# EAGLE design ssslidar_v0.1_main_board (EAGLE 7.6.0)
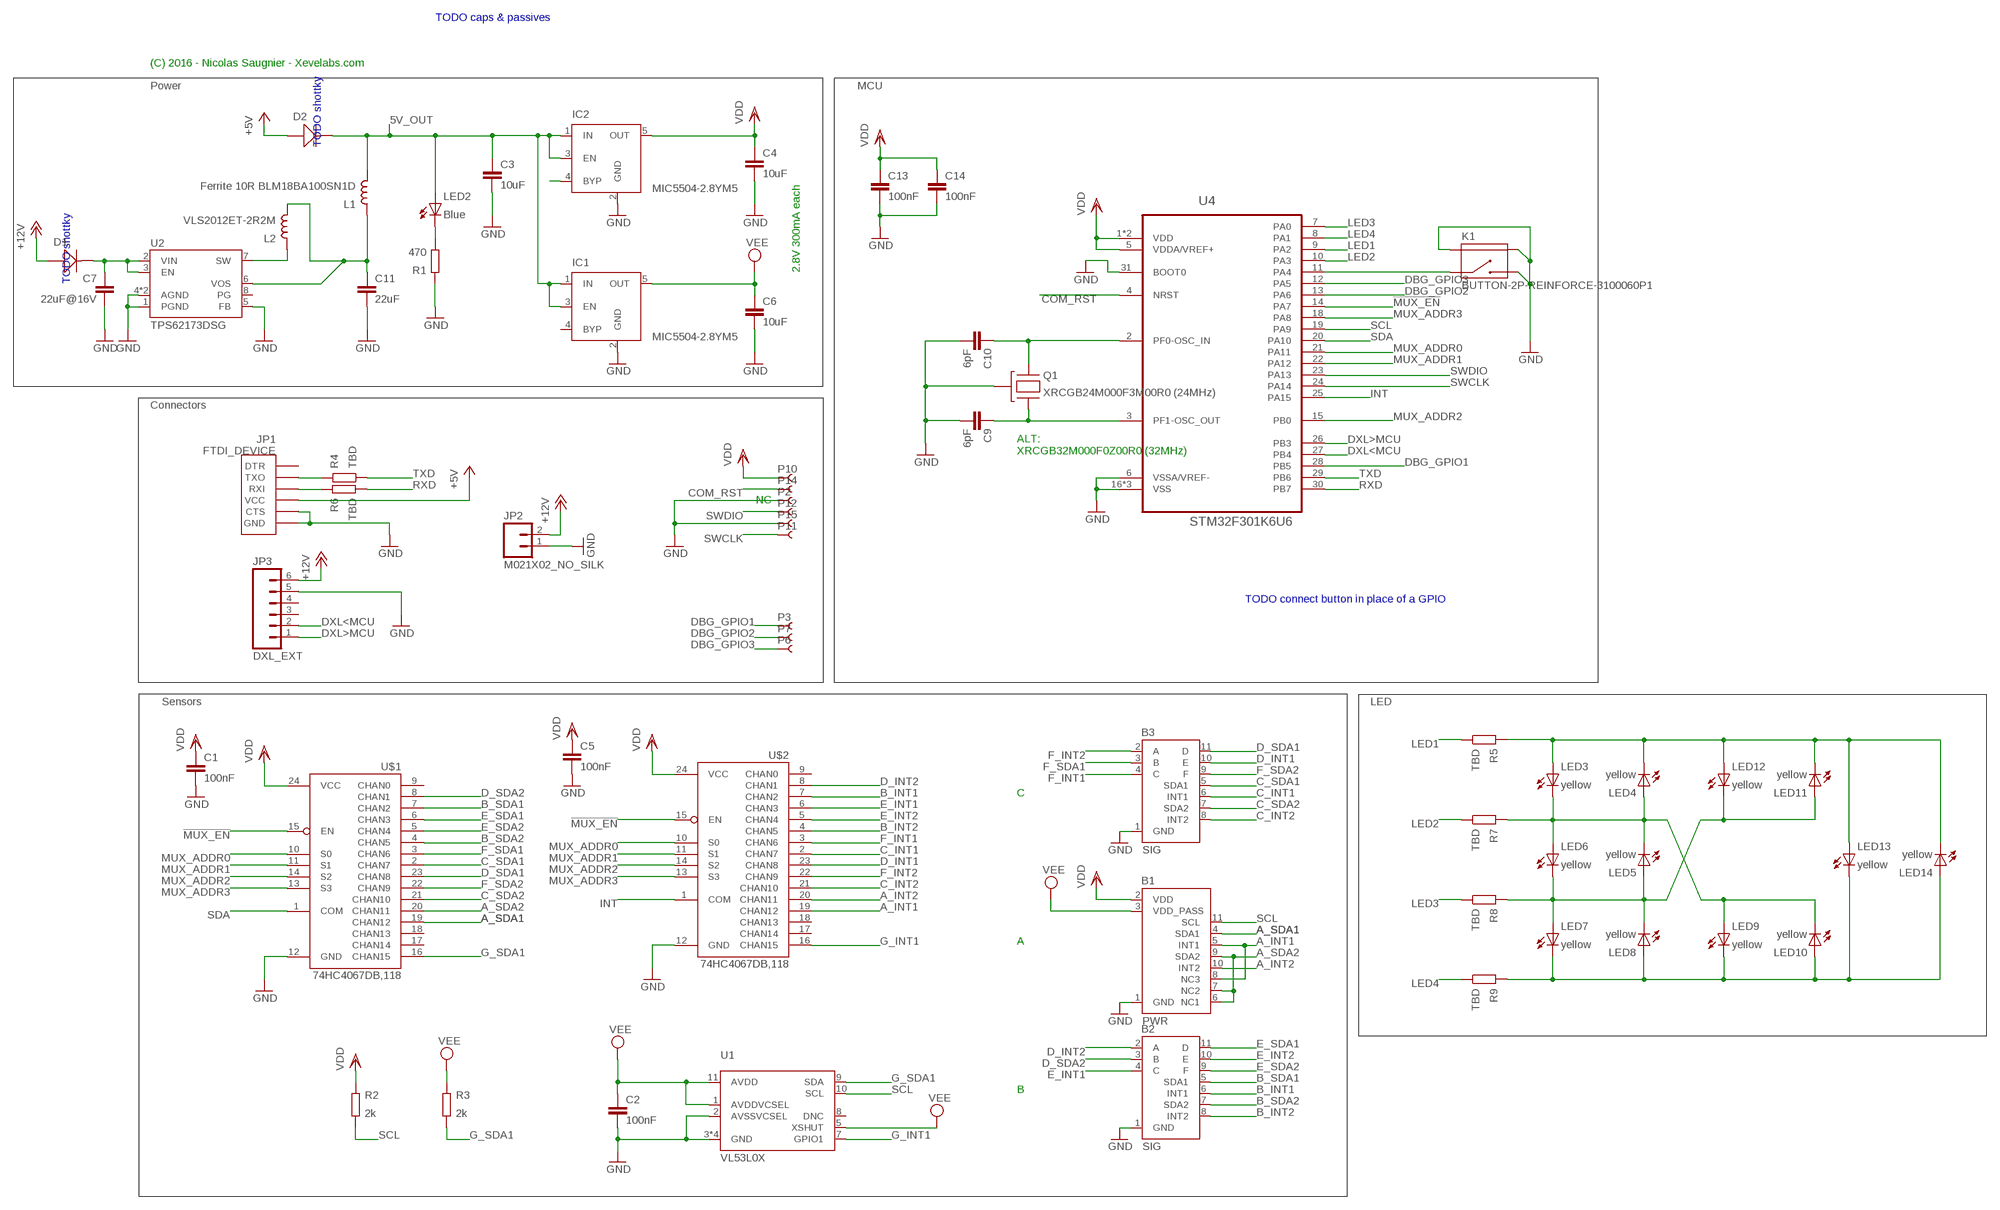
[diagram p0: schematic, sheet 1]

## Parts
B1  PWR  BLADE_PWR_BOTTOM  [BLADE]
B2  SIG  BLADE_SIG_BOTTOM  [BLADE]
B3  SIG  BLADE_SIG_BOTTOM  [BLADE]
C1  100nF  C0402  [0402_N]
C2  100nF  C0402  [0402_N]
C3  10uF  C0805  [0805_N]
C4  10uF  C0805  [0805_N]
C5  100nF  C0402  [0402_N]
C6  10uF  C0805  [0805_N]
C7  22uF@16V  C1206_L  [1206_L]
C9  6pF  C0402  [0402_N]
C10  6pF  C0402  [0402_N]
C11  22uF  C1206_L  [1206_L]
C13  100nF  C0402  [0402_N]
C14  100nF  C0402  [0402_N]
D1  D-SOD-123  [SOD123]
D2  D-SOD-123  [SOD123]
IC1  MIC5504-2.8YM5  MIC5219XX  [SOT23-5]
IC2  MIC5504-2.8YM5  MIC5219XX  [SOT23-5]
JP1  FTDI_DEVICE  [FTDI_DEVICE_SIDE]
JP2  M021X02_NO_SILK  [1X02_NO_SILK]
JP3  DXL_EXT  M061.27MM  [1X06-1.27MM]
K1  BUTTON-2P-REINFORCE-3100060P1  [4P-SMD-7.0X3.5X3.5H-90D]
L1  Ferrite 10R BLM18BA100SN1D  L0603  [0603_N]
L2  VLS2012ET-2R2M  L2016M  [2016_METRIC_N]
LED2  Blue  LED0603  [D_0603_N]
LED3  yellow  LED0603  [D_0603_N]
LED4  yellow  LED0603  [D_0603_N]
LED5  yellow  LED0603  [D_0603_N]
LED6  yellow  LED0603  [D_0603_N]
LED7  yellow  LED0603  [D_0603_N]
LED8  yellow  LED0603  [D_0603_N]
LED9  yellow  LED0603  [D_0603_N]
LED10  yellow  LED0603  [D_0603_N]
LED11  yellow  LED0603  [D_0603_N]
LED12  yellow  LED0603  [D_0603_N]
LED13  yellow  LED0603  [D_0603_N]
LED14  yellow  LED0603  [D_0603_N]
P2  PIN_SMD_1X1.6  [PIN_SMD_1X1.6]
P3  PIN_SMD_1X1  [PIN_SMD_1X1]
P6  PIN_SMD_1X1  [PIN_SMD_1X1]
P7  PIN_SMD_1X1  [PIN_SMD_1X1]
P10  PIN_SMD_1X1.6  [PIN_SMD_1X1.6]
P11  PIN_SMD_1X1.6  [PIN_SMD_1X1.6]
P12  PIN_SMD_1X1.6  [PIN_SMD_1X1.6]
P14  PIN_SMD_1X1.6  [PIN_SMD_1X1.6]
P15  PIN_SMD_1X1.6  [PIN_SMD_1X1.6]
Q1  XRCGB24M000F3M00R0 (24MHz)  CRYSTAL_W/BODY-2.0X1.6  [CRYSTAL_2.0X1.6_4P]
R1  470  R0402  [0402_N]
R2  2k  R0402  [0402_N]
R3  2k  R0402  [0402_N]
R4  TBD  R0402  [0402_N]
R5  TBD  R0402  [0402_N]
R6  TBD  R0402  [0402_N]
R7  TBD  R0402  [0402_N]
R8  TBD  R0402  [0402_N]
R9  TBD  R0402  [0402_N]
U1  VL53L0X  [VL53L0X]
U2  TPS62173DSG  IC_TPS62160DSG_N  [SON50P200X200X80-9N]
U4  STM32F301K6U6  [QFN50P500X500X60-33N]
U$1  74HC4067DB,118  MUX-74HC4067SMD  [SSOP24]
U$2  74HC4067DB,118  MUX-74HC4067SMD  [SSOP24]

## Nets
5V_OUT: C3.1 D2.- IC1.1(IN) IC1.3(EN) IC2.1(IN) IC2.3(EN) L1.2 LED2.A
!MUX_EN: U4.14(PA7) U$1.15(EN) U$2.15(EN)
+5V: D2.+ JP1.P$4(VCC)
+12V: D1.+ JP2.2 JP3.6
A_INT1: B1.5(INT1) B1.8(NC3) U$2.19(CHAN12)
A_INT2: B1.10(INT2) U$2.20(CHAN11)
A_SDA1: B1.4(SDA1) U$1.19(CHAN12)
A_SDA2: B1.6(NC1) B1.7(NC2) B1.9(SDA2) U$1.20(CHAN11)
B_INT1: B2.6(INT1) U$2.7(CHAN2)
B_INT2: B2.8(INT2) U$2.4(CHAN5)
B_SDA1: B2.5(SDA1) U$1.7(CHAN2)
B_SDA2: B2.7(SDA2) U$1.4(CHAN5)
C_INT1: B3.6(INT1) U$2.2(CHAN7)
C_INT2: B3.8(INT2) U$2.21(CHAN10)
C_SDA1: B3.5(SDA1) U$1.2(CHAN7)
C_SDA2: B3.7(SDA2) U$1.21(CHAN10)
COM_RST: P14.PIN U4.4(NRST)
D_INT1: B3.10(E) U$2.23(CHAN8)
D_INT2: B2.2(A) U$2.8(CHAN1)
D_SDA1: B3.11(D) U$1.23(CHAN8)
D_SDA2: B2.3(B) U$1.8(CHAN1)
DBG_GPIO1: P3.P$1 U4.28(PB5)
DBG_GPIO2: P7.P$1 U4.13(PA6)
DBG_GPIO3: P6.P$1 U4.12(PA5)
DXL<MCU: JP3.2 U4.27(PB4)
DXL>MCU: JP3.1 U4.26(PB3)
E_INT1: B2.4(C) U$2.6(CHAN3)
E_INT2: B2.10(E) U$2.5(CHAN4)
E_SDA1: B2.11(D) U$1.6(CHAN3)
E_SDA2: B2.9(F) U$1.5(CHAN4)
F_INT1: B3.4(C) U$2.3(CHAN6)
F_INT2: B3.2(A) U$2.22(CHAN9)
F_SDA1: B3.3(B) U$1.3(CHAN6)
F_SDA2: B3.9(F) U$1.22(CHAN9)
G_INT1: U1.7(GPIO1) U$2.16(CHAN15)
G_SDA1: R3.1 U1.9(SDA) U$1.16(CHAN15)
GND: B1.1(GND) B2.1(GND) B3.1(GND) C1.2 C2.2 C3.2 C4.2 C5.2 C6.2 C7.2 C9.2 C10.2 C11.2 C13.2 C14.2 IC1.2(GND) IC2.2(GND) JP1.P$5(CTS) JP1.P$6(GND) JP2.1 JP3.5 K1.2 K1.S1 K1.S2 P2.PIN P15.PIN Q1.2(GND) Q1.4(GND) R1.2 U1.2(AVSSVCSEL) U1.3(GND) U1.4(GND) U1.6(GND) U1.12(GND) U2.1(PGND) U2.4(AGND) U2.5(FB) U2.9(AGND) U4.6(VSSA/VREF-) U4.16(VSS) U4.31(BOOT0) U4.32(VSS) U4.33(VSS) U$1.12(GND) U$2.12(GND)
INT: U4.25(PA15) U$2.1(COM)
LED1: R5.1 U4.9(PA2)
LED2: R7.1 U4.10(PA3)
LED3: R8.1 U4.7(PA0)
LED4: R9.1 U4.8(PA1)
MUX_ADDR0: U4.21(PA11) U$1.10(S0) U$2.10(S0)
MUX_ADDR1: U4.22(PA12) U$1.11(S1) U$2.11(S1)
MUX_ADDR2: U4.15(PB0) U$1.14(S2) U$2.14(S2)
MUX_ADDR3: U4.18(PA8) U$1.13(S3) U$2.13(S3)
N$1: C10.1 Q1.1 U4.2(PF0-OSC_IN)
N$2: C9.1 Q1.3 U4.3(PF1-OSC_OUT)
N$3: L2.1 U2.7(SW)
N$4: K1.1 U4.11(PA4)
N$5: C7.1 D1.- U2.2(VIN) U2.3(EN)
N$6: C11.1 L1.1 L2.2 U2.6(VOS)
N$8: LED2.C R1.1
N$9: LED3.A LED4.C LED11.C LED12.A LED13.A LED14.C R5.2
N$10: LED3.C LED4.A LED5.C LED6.A LED9.A LED10.C R7.2
N$11: LED5.A LED6.C LED7.A LED8.C LED11.A LED12.C R8.2
N$12: LED7.C LED8.A LED9.C LED10.A LED13.C LED14.A R9.2
N$13: JP1.P$2(TXO) R4.2
N$14: JP1.P$3(RXI) R6.2
N$15: IC2.4(BYP)
RXD: R6.1 U4.30(PB7)
SCL: B1.11(SCL) R2.1 U1.10(SCL) U4.19(PA9)
SDA: U4.20(PA10) U$1.1(COM)
SWCLK: P11.PIN U4.24(PA14)
SWDIO: P12.PIN U4.23(PA13)
TXD: R4.1 U4.29(PB6)
VDD: B1.2(VDD) C1.1 C4.1 C5.1 C13.1 C14.1 IC2.5(OUT) P10.PIN R2.2 U4.1(VDD) U4.5(VDDA/VREF+) U4.17(VDD) U$1.24(VCC) U$2.24(VCC)
VEE: B1.3(VDD_PASS) C2.1 C6.1 IC1.5(OUT) R3.2 U1.1(AVDDVCSEL) U1.5(XSHUT) U1.11(AVDD)
Unconnected: IC1.4(BYP) JP1.P$1(DTR) JP3.3 JP3.4 U1.8(DNC) U2.8(PG) U$1.9(CHAN0) U$1.17(CHAN14) U$1.18(CHAN13) U$2.9(CHAN0) U$2.17(CHAN14) U$2.18(CHAN13)

## Notes on the sheet
- TODO caps & passives
- (C) 2016 - Nicolas Saugnier - Xevelabs.com
- Power | MCU
- TODO shottky
- 2.8V 300mA each
- TODO shottky
- Connectors
- ALT:
  XRCGB32M000F0Z00R0 (32MHz)
- NC
- TODO connect button in place of a GPIO
- Sensors | LED
- C
- A
- B

## Library data of the parts
B1 = ssslidar:BLADE_PWR_BOTTOM
B2 B3 = ssslidar:BLADE_SIG_BOTTOM
C1-C7 C9-C11 C13 C14 = Xevelabs:C: Non-polarized Capacitor
D1 D2 = OPL:D*: DIODE
IC1 IC2 = v-reg-micrel:MIC5219XX: VOLTAGE REGULATOR; OC_FARNELL: unknown; OC_NEWARK: unknown
JP1 = SparkFun-Connectors:FTDI_DEVICE: Connector which mates to FTDI basic or FTDI cable.
JP2 = SparkFun-Connectors:M02: Standard 2-pin 0.1" header. Use with - straight break away headers ( PRT-00116) - right angle break away headers (PRT-00553) - swiss pins (PRT-00743) - machine pins (PRT-00117) - female headers (PRT-00115) Molex polarized connector foot print use with: PRT-08233 with associated crimp pins and housings. 2.54_SCREWTERM for use with PRT-10571. 3.5mm Screw Terminal footprints for PRT-08084 5mm Screw Terminal footprints for use with PRT-08433
JP3 = SparkFun-Connectors:M06: Header 6 Standard 6-pin 0.1" header. Use with straight break away headers (SKU : PRT-00116), right angle break away headers (PRT-00553), swiss pins (PRT-00743), machine pins (PRT-00117), and female headers (PRT-00115). Molex polarized connector foot print use with SKU : PRT-08094 with associated crimp pins and housings. NOTES ON THE VARIANTS LOCK and LOCK_LONGPADS... This footprint was designed to help hold the alignment of a through-hole component (i.e. 6-pin header) while soldering it into place. You may notice that each hole has been shifted either up or down by 0.005 of an inch from it's more standard position (which is a perfectly straight line). This slight alteration caused the pins (the squares in the middle) to touch the edges of the holes. Because they are alternating, it causes a "brace" to hold the component in place. 0.005 has proven to be the perfect amount of "off-center" position when using our standard breakaway headers. Although looks a little odd when you look at the bare footprint, once you have a header in there, the alteration is very hard to notice. Also,if you push a header all the way into place, it is covered up entirely on the bottom side. This idea of altering the position of holes to aid alignment will be further integrated into the Sparkfun Library for other footprints. It can help hold any component with 3 or more connection pins.
K1 = OPL:BUTTON-2P-REINFORCE: TS-1188E http://www.best-dz.com/?thread-374-2.html SMD Button
L1 L2 = Xevelabs:L
LED2-LED14 = Xevelabs:LED: LED
P2 P3 P6 P7 P10-P12 P14 P15 = Xevelabs:PIN
Q1 = Xevelabs:CRYSTAL_W/BODY: Crystal oscillator, with connection to the body.
R1-R9 = Xevelabs:R: Resistor
U1 = VL53L0X:VL53L0X: VL53L0X distance sensor
U2 = Xevelabs:IC_TPS62160
U4 = stm32F301:STM32F301K6U6: ARM-based 32-bit MCU,32UFQFN; MPN: STM32F050K4U6A; OC_FARNELL: 2115060; OC_NEWARK: 05W5798; PACKAGE: UFQFN-32; SUPPLIER: STMICROELECTRONICS
U$1 U$2 = SparkFun-AnalogIC:MUX-74HC4067: 16-channel analog MUX

## Board
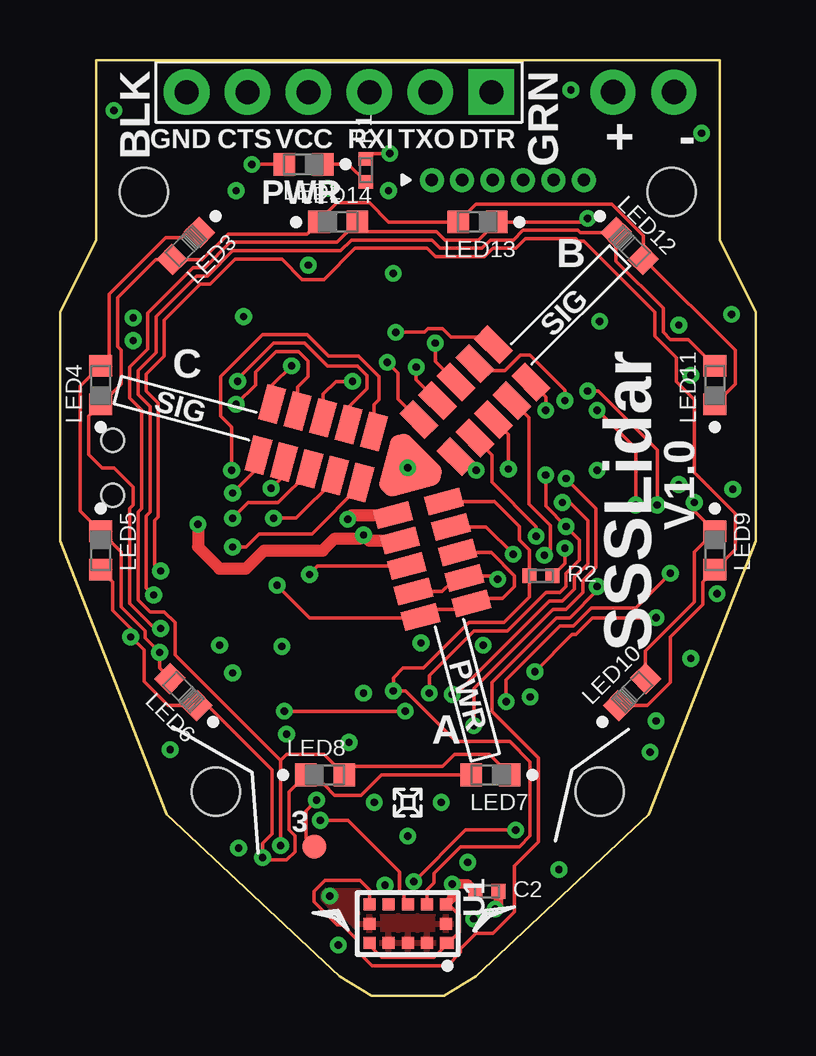
[diagram p1: board, top side]
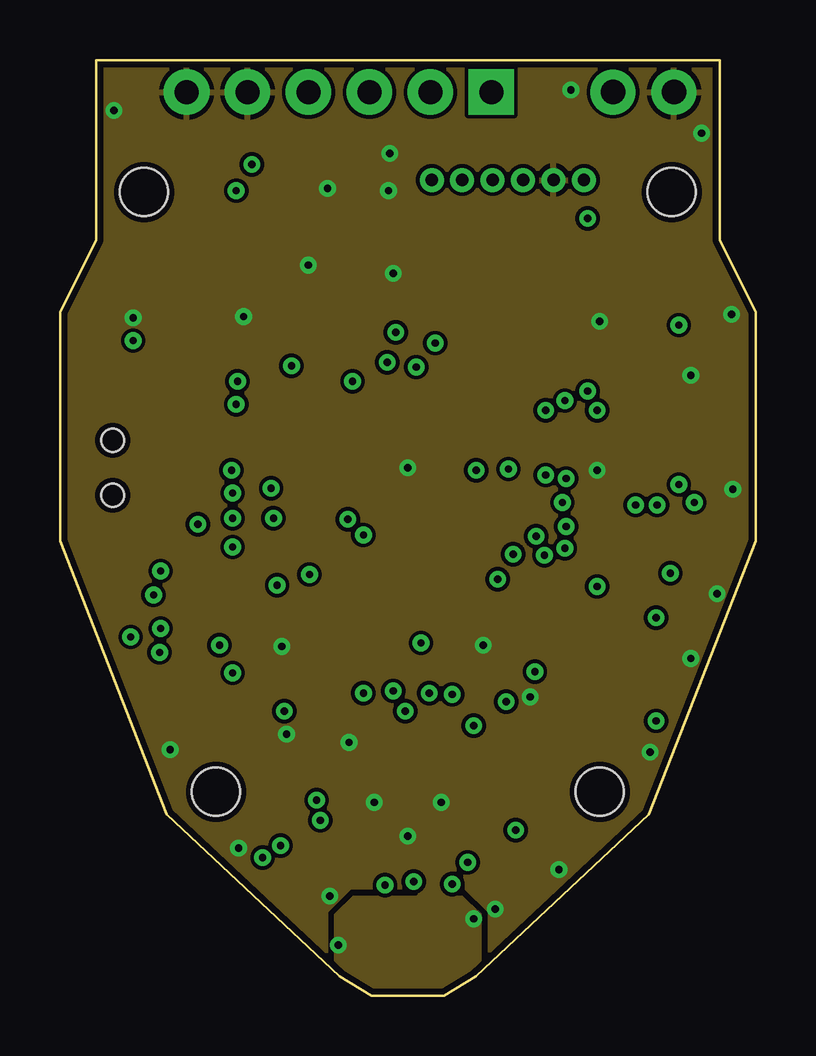
[diagram p2: board, inner layer Route2]
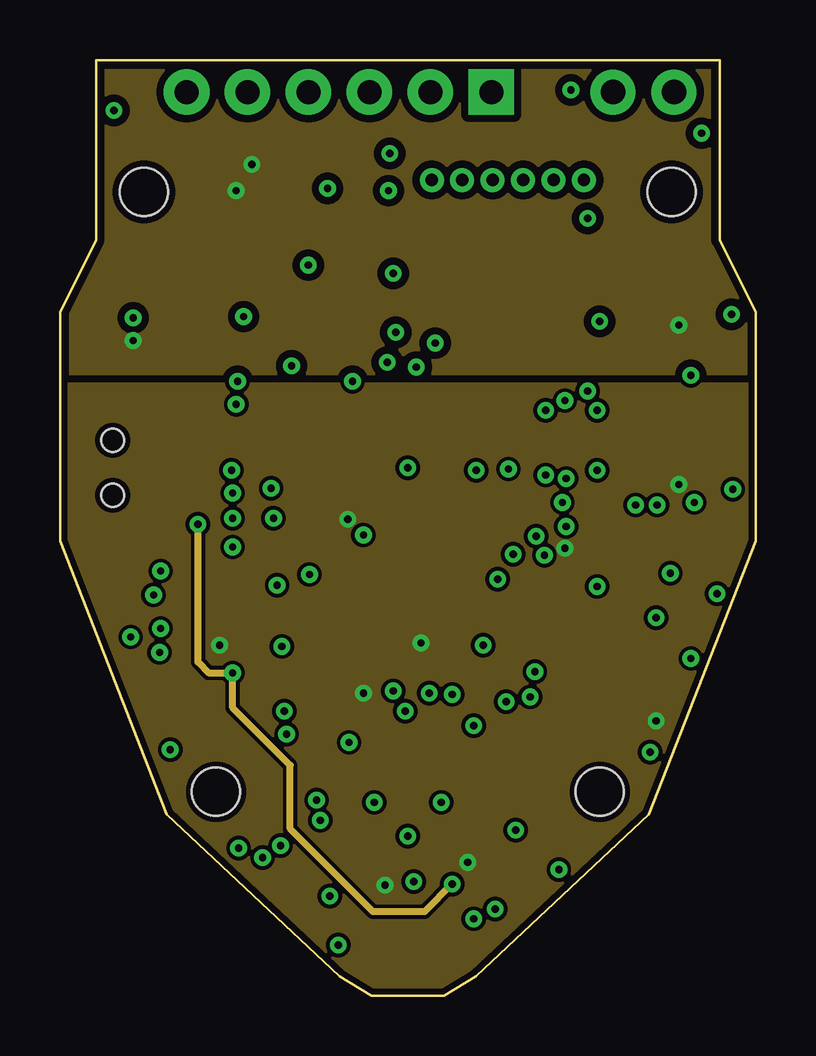
[diagram p3: board, inner layer Route3]
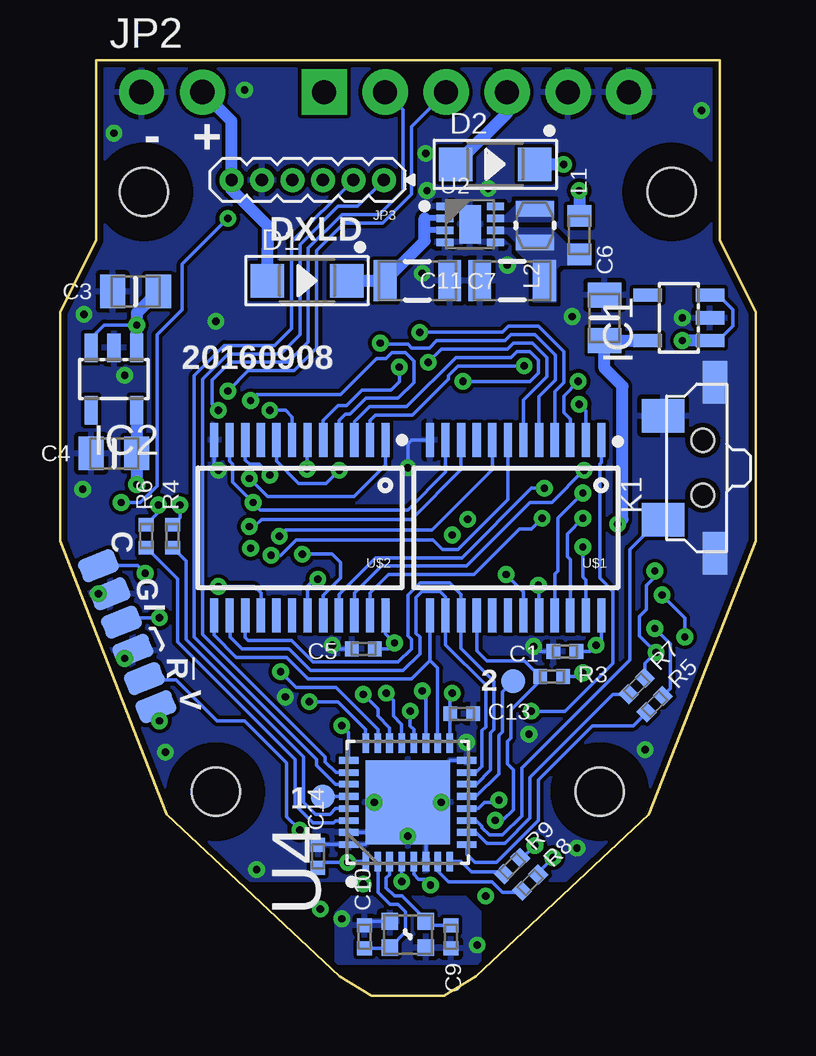
[diagram p4: board, bottom side, seen from below]

Size 29 x 39 mm. Coordinates in mm from the lower left corner, seen from the top.
Outline: 1.5,31.5 0,28.5 0,18.95 4.45,7.55 11.65,0.8 13,0 16,0 17.35,0.8 24.55,7.55 29,18.95 29,28.5 27.5,31.5 27.5,39 1.5,39 1.5,31.5
Copper layers (1*2*3*16): Top 0.035mm / dielectric 0.15mm / Route2 0.035mm / dielectric 1.1mm / Route3 0.035mm / dielectric 0.15mm / Bottom 0.035mm
Design rules "Xevelabs_6mil_4layers_eurocircuits *": minimum track width 0.15mm, minimum drill 0.25mm, track to track 0.155mm, track to pad 0.155mm, pad to pad 0.155mm, via to via 0.155mm, smd to smd 0mil, copper to edge 0.25mm, drill to drill 0.25mm, minimum pad ring 0.15mm, minimum via ring 0.2mm, stop-mask expansion 0mil, vias tented up to drill 100mil, thermal gap 0.2mm
Holes 2 mm at 25.5,33.5 3.5,33.5 6.5,8.5 22.5,8.5
tKeepout: area 1.5,31.5 to 5.5,35.5; area 4.5,6.5 to 8.5,10.5; area 20.5,6.5 to 24.5,10.5
bKeepout: area 3.5,5.5 to 9.5,11.5; area 19.5,5.5 to 25.5,11.5; area 0.5,30.5 to 6.5,36.5; area 22.5,30.5 to 28.5,36.5
bRestrict: area 23.5,31.5 to 27.5,35.5; area 4.5,6.5 to 8.5,10.5; area 20.5,6.5 to 24.5,10.5; area 1.5,31.5 to 5.5,35.5

### Footprints (pad centres in the part's own frame; a part is rotated, then mirrored left to right if it is on the bottom)
BLADE = smd 1 x 2.5: 1 0.5,0 | smd 0.8 x 1.5: 2 1.75,-1.1; 3 2.85,-1.1; 4 3.95,-1.1; 5 5.05,-1.1; 6 6.15,-1.1; 7 6.15,1.1; 8 5.05,1.1; 9 3.95,1.1; 10 2.85,1.1; 11 1.75,1.1
0402_N = smd 0.57 x 0.62: 1 -0.48,0; 2 0.48,0
0805_N = smd 1.05 x 1.4: 1 -0.95,0; 2 0.95,0
1206_L = smd 0.95 x 1.7: 1 -1.35,0; 2 1.35,0
SOD123 = smd 1.397 x 1.397: + -1.651,0; - 1.651,0
SOT23-5 = smd 0.55 x 1.2: 1 -0.95,-1.3; 2 0,-1.3; 3 0.95,-1.3; 4 0.95,1.3; 5 -0.95,1.3
FTDI_DEVICE_SIDE = drill 1 pad 1.9 square: P$1 -6.35,0 | drill 1 pad 1.9: P$2 -3.81,0; P$3 -1.27,0; P$4 1.27,0; P$5 3.81,0; P$6 6.35,0
1X02_NO_SILK = drill 1.016 pad 1.88: 1 0,0; 2 2.54,0
1X06-1.27MM = drill 0.508 pad 1: 1 0,0; 2 1.27,0; 3 2.54,0; 4 3.81,0; 5 5.08,0; 6 6.35,0
4P-SMD-7.0X3.5X3.5H-90D = smd 1.397 x 1.778: 1 -2.159,1.651; 2 2.159,1.651 | smd 1.778 x 1.016: S1 -3.556,-0.508; S2 3.556,-0.508 | hole 0.95: -1.15,0; 1.15,0
0603_N = smd 0.9 x 1: 1 -0.8,0; 2 0.8,0
2016_METRIC_N = smd 0.65 x 1.6: 1 -0.7,0; 2 0.7,0
D_0603_N = smd 0.9 x 0.95: A 0.8,0; C -0.8,0
PIN_SMD_1X1.6 = smd 1.6 x 1: PIN 0,0
PIN_SMD_1X1 = smd 1 x 1: P$1 0,0
CRYSTAL_2.0X1.6_4P = smd 0.7 x 0.7: 1 -0.75,-0.55; 2 0.75,-0.55; 3 0.75,0.55; 4 -0.75,0.55
VL53L0X = smd 0.5 x 0.58: 1 0.8,1.64 | smd 0.5 x 0.5: 2 0.8,0.8; 3 0.8,0; 4 0.8,-0.8; 5 0.8,-1.6; 6 0,-1.6; 7 -0.8,-1.6; 8 -0.8,-0.8; 9 -0.8,0; 10 -0.8,0.8; 11 -0.8,1.6; 12 0,1.6
SON50P200X200X80-9N = smd 0.7 x 0.3: 1 -1.05,0.75; 2 -1.05,0.25; 3 -1.05,-0.25; 4 -1.05,-0.75; 5 1.05,-0.75; 6 1.05,-0.25; 7 1.05,0.25; 8 1.05,0.75 | smd 0.9 x 1.6: 9 0,0
QFN50P500X500X60-33N = smd 0.813 x 0.279: 1 -2.464,1.753; 2 -2.464,1.245; 3 -2.464,0.762; 4 -2.464,0.254; 5 -2.464,-0.254; 6 -2.464,-0.762; 7 -2.464,-1.245; 8 -2.464,-1.753; 17 2.464,-1.753; 18 2.464,-1.245; 19 2.464,-0.762; 20 2.464,-0.254; 21 2.464,0.254; 22 2.464,0.762; 23 2.464,1.245; 24 2.464,1.753 | smd 0.279 x 0.813: 9 -1.753,-2.464; 10 -1.245,-2.464; 11 -0.762,-2.464; 12 -0.254,-2.464; 13 0.254,-2.464; 14 0.762,-2.464; 15 1.245,-2.464; 16 1.753,-2.464; 25 1.753,2.464; 26 1.245,2.464; 27 0.762,2.464; 28 0.254,2.464; 29 -0.254,2.464; 30 -0.762,2.464; 31 -1.245,2.464; 32 -1.753,2.464 | smd 3.505 x 3.505: 33 0,0
SSOP24 = smd 0.348 x 1.397: 1 -3.575,-3.656; 2 -2.925,-3.656; 3 -2.275,-3.656; 4 -1.625,-3.656; 5 -0.975,-3.656; 6 -0.325,-3.656; 7 0.325,-3.656; 8 0.975,-3.656; 9 1.625,-3.656; 10 2.275,-3.656; 11 2.925,-3.656; 12 3.575,-3.656; 13 3.575,3.656; 14 2.925,3.656; 15 2.275,3.656; 16 1.625,3.656; 17 0.975,3.656; 18 0.325,3.656; 19 -0.325,3.656; 20 -0.975,3.656; 21 -1.625,3.656; 22 -2.275,3.656; 23 -2.925,3.656; 24 -3.575,3.656

### Placement (x,y rotation side)
B1  14.5,22 285 top
B2  14.5,22 45 top
B3  14.5,22 165 top
C1  7.95,14.35 180 bottom
C2  17.8,4.35 0 top
C3  25.85,29.35 180 bottom
C4  26.75,22.6 180 bottom
C5  16.35,14.45 180 bottom
C6  6.3,28.25 90 bottom
C7  14.1,29.8 0 bottom
C9  12.7,2.45 270 bottom
C10  16.3,2.45 90 bottom
C11  10.15,29.8 180 bottom
C13  12.25,11.75 0 bottom
C14  18.25,5.8 90 bottom
D1  18.7,29.8 0 bottom
D2  10.85,34.65 0 bottom
IC1  3.2,28.25 90 bottom
IC2  26.75,25.7 180 bottom
JP1  11.63,37.66 180 top
JP2  25.6,37.66 0 bottom
JP3  15.5,34 180 bottom
K1  2.2,22 90 bottom
L1  7.35,31.7 90 bottom
L2  9.2,32.1 270 bottom
LED2  10.15,34.65 180 top
LED3  5.25,31.25 225 top
LED4  1.7,25.45 90 top
LED5  1.7,18.55 270 top
LED6  5.15,12.65 135 top
LED7  17.95,9.2 180 top
LED8  11.05,9.2 0 top
LED9  27.3,18.55 270 top
LED10  23.85,12.65 45 top
LED11  27.3,25.45 90 top
LED12  23.75,31.25 315 top
LED13  17.4,32.25 180 top
LED14  11.6,32.25 0 top
P2  25.96,14.39 22 bottom
P3  18.05,8.3 90 bottom
P6  10.6,6.2 90 top
P7  10.1,13.1 90 bottom
P10  25.01,12.03 22 bottom
P11  27.39,17.92 22 bottom
P12  26.44,15.56 22 bottom
P14  25.49,13.21 22 bottom
P15  26.91,16.74 22 bottom
Q1  14.5,2.55 0 bottom
R1  12.75,34.4 90 top
R2  20.05,17.5 0 top
R3  8.5,13.3 0 bottom
R4  24.3,19.15 90 bottom
R5  4.2,12.15 45 bottom
R6  25.4,19.15 90 bottom
R7  4.95,12.9 45 bottom
R8  9.4,4.7 45 bottom
R9  10.15,5.4 45 bottom
U1  14.5,3 270 top
U2  11.9,32.15 0 bottom
U4  14.5,8.05 90 bottom
U$1  10,19.5 180 bottom
U$2  19,19.5 180 bottom
U$3  [XEVELABS_LOGO_S]  14.45,8 0 top

### Tracks (layer width: path | path; a pad name or v marks a point on that pad's centre or on a via)
5V_OUT  (via drill 0.3)
  Top 0.15: LED2.A v8,34.65
  Bottom 0.15: IC2.3 27.7,27.4 27.15,27.95 v25.8,27.95 | IC1.3 1.55,29.2 0.95,28.6 0.95,27.9 1.55,27.3 IC1.1
  Bottom 0.5: IC2.1 v25.8,27.95 25.8,28.45 C3.1 | IC1.1 v3.05,27.3 | D2.- v8,34.65 | v7.35,33.55 L1.2
  pour Route3 (isolate 0.3, rank 3): 0.8,42.1 31.25,42.4 29.55,25.5 -0.4,25.5 -0.35,41.95
!MUX_EN
  Bottom 0.15: U$2.15 21.27,14.93 21.15,14.8 19.35,14.8 18.45,13.9 14.9,13.9 14.35,14.45 14.35,14.85 14.5,15 14.5,16.7 14,17.2 12.75,17.2 12.28,16.73 U$1.15 12.28,14.47 10.9,13.1 10.9,11.1 11.05,10.95 11.05,9.4 11.64,8.81 U4.14
+5V
  Bottom 0.5: D2.+ 10.36,36.79 JP1.P$4
+12V
  Bottom 0.5: JP2.2 21.85,36.45 JP3.6 21.85,33.6 20.35,32.1 20.35,31.1 D1.+
A_INT1  (via drill 0.3)
  Top 0.15: B1.5 15.94,16.84 16.32,17.23 16.51,17.41 | 16.51,17.41 16.6,17.5 18.1,17.5 v18.25,17.35 | B1.8 16.51,17.41
  Bottom 0.15: U$2.19 18.68,17.07 18.4,17.35 v18.25,17.35
A_INT2  (via drill 0.3)
  Top 0.15: B1.10 17.77,19.53 v18.9,18.4
  Bottom 0.15: U$2.20 18.02,16.68 17.3,17.4 17.3,18.05 17.65,18.4 v18.9,18.4
A_SDA1  (via drill 0.3)
  Top 0.15: v10.4,17.55 10.75,17.9 B1.4
  Bottom 0.15: U$1.19 9.68,16.82 v10.4,17.55
A_SDA2  (via drill 0.3)
  Top 0.15: 15,15.75 15.35,16.1 16.75,16.1 17.2,16.55 17.25,16.55 | 17.25,16.55 18.45,16.55 18.95,17.05 18.95,17.5 17.98,18.47 B1.9 | 15,15.75 B1.6 | B1.7 17.15,16.45 17.25,16.55 | v9.05,17.1 10.4,15.75 15,15.75
  Bottom 0.15: U$1.20 9.03,17.07 v9.05,17.1
B_INT1  (via drill 0.3)
  Top 0.15: B2.6 20.25,24.95 v20.25,24.4
  Bottom 0.15: U$2.7 19.32,24.12 19.6,24.4 v20.25,24.4
B_INT2  (via drill 0.3)
  Top 0.15: v21.05,24.8 21.05,25.25 19.6,26.7 19.2,26.7 18.55,26.05 17.59,26.05 B2.8
  Bottom 0.15: U$2.4 17.38,23.98 17.1,24.25 16.9,24.25 16.25,24.9 14.9,24.9 14.25,25.55 14.25,26.45 14.6,26.8 15.15,26.8 15.4,26.55 15.8,26.55 17.3,25.05 20.8,25.05 v21.05,24.8
B_SDA1  (via drill 0.3)
  Top 0.15: B2.5 19.55,24.09 19.55,20.5 20.45,19.6 20.45,18.6 v20.2,18.35
  Bottom 0.15: U$1.7 10.32,20.68 12.4,18.6 13.05,18.6 13.45,19 19.15,19 19.8,18.35 v20.2,18.35
B_SDA2  (via drill 0.3)
  Top 0.15: v14,27.65 15.2,27.65 15.35,27.8 15.95,27.8 16.3,27.45 17.75,27.45 B2.7
  Bottom 0.15: v14,27.65 10.55,27.65 10.3,27.9 9.05,27.9 8,26.85 8,25.55 8.38,25.18 U$1.4
C_INT1  (via drill 0.3)
  Top 0.15: B3.6 8.84,25.44 v9.65,26.25
  Bottom 0.15: U$2.2 16.07,23.98 15.85,24.2 14.3,24.2 12.8,25.7 12.8,25.85 12.4,26.25 v9.65,26.25
C_INT2  (via drill 0.3)
  Top 0.15: B3.8 9.34,21.69 v8.8,21.15
  Bottom 0.15: U$2.21 17.38,16.73 15.85,18.25 12.25,18.25 9.35,21.15 v8.8,21.15
C_SDA1  (via drill 0.3)
  Top 0.15: v7.35,24.65 8.15,25.45 8.15,26 9,26.85 9.95,26.85 10.35,26.45 10.35,25.8 9.91,25.36 B3.5
  Bottom 0.15: U$1.2 7.08,24.38 v7.35,24.65
C_SDA2  (via drill 0.3)
  Top 0.15: v7.2,20.95 8.1,21.85 8.1,22.35 B3.7
  Bottom 0.15: v7.2,20.95 8.25,19.9 8.25,17.7 8.38,17.57 U$1.21
COM_RST  (via drill 0.3)
  Top 0.15: v14.75,4.75 16.9,6.9 v19,6.9
  Bottom 0.15: U4.4 v14.75,4.75 | v19,6.9 19.55,7.45 19.55,9.7 21.3,11.45 22.45,11.45 24.15,13.15 25.43,13.15 P14.PIN
D_INT1  (via drill 0.3)
  Top 0.15: 11.46,21.76 B3.10 11.46,21.51 9.85,19.9 v8.9,19.9
  Bottom 0.15: v8.9,19.9 9.35,19.45 9.85,19.45 11.75,17.55 15.3,17.55 16.07,16.77 U$2.23
D_INT2  (via drill 0.3)
  Top 0.15: B2.2 16.52,22.73 v17.35,21.9
  Bottom 0.15: v17.35,21.9 17.9,21.35 19.05,21.35 19.98,22.27 U$2.8
D_SDA1  (via drill 0.3)
  Top 0.15: v7.2,18.7 7.75,18.7 8.3,19.25 10.5,19.25 12.53,21.27 B3.11
  Bottom 0.15: U$1.23 7.08,17.32 7.2,17.45 v7.2,18.7
D_SDA2  (via drill 0.3)
  Top 0.15: v19.85,19.15 19.85,19.55 18,21.4 18,22.53 B2.3
  Bottom 0.15: U$1.8 10.97,21.93 13.5,19.4 19.6,19.4 v19.85,19.15
DBG_GPIO1
  Bottom 0.15: P3.P$1 U4.28
DBG_GPIO2
  Bottom 0.15: U4.13 11.65,8.3 10.7,9.25 10.7,10.85 10.55,11 10.55,12.65 P7.P$1
DBG_GPIO3  (via drill 0.3)
  Top 0.15: v10.7,8.15 10.25,7.7 10.25,6.55 P6.P$1
  Bottom 0.15: U4.12 11.55,7.8 11.3,8.05 10.8,8.05 v10.7,8.15
DXL<MCU
  Bottom 0.15: U4.27 17.51,8.81 18.3,9.6 18.3,9.85 23.4,14.95 23.4,25.85 22.15,27.1 20.05,27.1 19.35,27.8 19.35,31.42 JP3.2
DXL>MCU
  Bottom 0.15: JP3.1 16.6,32.9 17.4,32.9 19,31.3 19,27.55 19.8,26.75 22,26.75 23.05,25.7 23.05,15.05 17.95,9.95 17.95,9.75 17.5,9.29 U4.26
E_INT1  (via drill 0.3)
  Top 0.15: B2.4 18.7,23.39 v18.7,21.95
  Bottom 0.15: U$2.6 18.7,23.13 v18.7,21.95
E_INT2  (via drill 0.3)
  Top 0.15: B2.10 14.85,25.68 v14.85,26.2
  Bottom 0.15: U$2.5 18.02,23.98 17.4,24.6 17.05,24.6 16.4,25.25 15.2,25.25 14.85,25.6 v14.85,26.2
E_SDA1  (via drill 0.3)
  Top 0.15: v13.65,26.4 14.1,25.95 14.1,24.88 B2.11
  Bottom 0.15: v13.65,26.4 13.1,26.95 10.35,26.95 10.1,27.2 9.3,27.2 8.7,26.6 8.7,25.8 9.68,24.82 U$1.6
E_SDA2  (via drill 0.3)
  Top 0.15: B2.9 15.65,26.44 v15.65,27.2
  Bottom 0.15: v15.65,27.2 15.6,27.15 14.5,27.15 14.35,27 13.6,27 13.3,27.3 10.45,27.3 10.2,27.55 9.2,27.55 8.35,26.7 8.35,25.65 9.03,24.98 U$1.5
F_INT1  (via drill 0.3)
  Top 0.15: v12.2,25.6 11.5,25.6 10.97,25.07 B3.4
  Bottom 0.15: U$2.3 16.73,23.93 16.1,24.55 14.55,24.55 12.5,26.6 10.2,26.6 9.95,26.85 9.4,26.85 9.05,26.5 9.05,25.95 9.4,25.6 v12.2,25.6
F_INT2  (via drill 0.3)
  Top 0.15: v7.15,21.9 7.15,23.7 6.7,24.15 6.7,25.8 8.45,27.55 10.3,27.55 11.2,26.65 12.45,26.65 13.3,25.8 13.3,24.85 13.09,24.64 B3.2
  Bottom 0.15: v7.15,21.9 8.5,20.55 9.4,20.55 12.05,17.9 15.6,17.9 16.73,16.77 U$2.22
F_SDA1  (via drill 0.3)
  Top 0.15: B3.3 12.03,24.53 12.8,25.3 12.8,25.85 12.4,26.25 11.15,26.25 10.2,27.2 8.9,27.2 7.4,25.7 v7.4,25.6
  Bottom 0.15: U$1.3 7.72,24.02 8,24.3 8,25 v7.4,25.6
F_SDA2  (via drill 0.3)
  Top 0.15: v7.2,19.9 7.85,20.55 9.1,20.55 10.4,21.85 B3.9
  Bottom 0.15: U$1.22 7.72,18.18 7.85,18.3 7.85,19.25 v7.2,19.9
G_INT1  (via drill 0.3)
  Top 0.15: U1.7 12.9,4.4 12.5,4.8 11.05,4.8 10.6,4.35 10.6,3.9 11.55,2.95 11.75,2.95 12.4,2.3 12.4,1.85 13,1.25 16.15,1.25 16.7,1.8 16.7,1.95 17.35,2.6 18.05,2.6 18.95,3.5 18.95,5.4 19.95,6.4 19.95,9.9 18,11.85 18,13.05 20.7,15.75 21.25,15.75 22.4,16.9 v22.4,17.05
  Bottom 0.15: U$2.16 20.62,16.77 20.9,17.05 v22.4,17.05
G_SDA1  (via drill 0.3)
  Top 0.15: U1.9 14.5,3.85 14.35,4 14.35,4.2 14.15,4.4 14.15,5.15 12,7.3 v10.85,7.3
  Bottom 0.15: U$1.16 11.62,14.38 11.2,13.95 9.63,13.95 R3.1 8.98,13.12 10.2,11.9 10.2,10.75 10.35,10.6 10.35,9.65 10.1,9.4 10.1,7.75 10.55,7.3 v10.85,7.3
GND  (via drill 0.3)
  Top 0.15: B3.1 14.37,22.13 v14.5,22 | B1.1 14.63,21.87 v14.5,22 | B2.1 v14.5,22 | v13.75,35.1 12.97,35.1 R1.2
  Top 0.4: C2.2 18.28,3.73 v18.15,3.6
  Bottom 0.15: U4.6 13.74,7.29 U4.33 | U4.31 15.75,6.8 U4.33 | U4.33 16.25,6.3 U4.32 18.23,6.3 C14.2 | U4.16 12.75,9.8 U4.33 | C10.2 16.13,3.1 Q1.4 | v14.5,22 14.5,23 14.35,23.15 U$1.12 | U$2.12 22.57,22.07 v22.4,21.9 | C1.2 9.05,14.35 v9.25,14.55 | C5.2 17.5,14.45 v17.65,14.6
  other vias: 17.25,3.2 11.6,2.1 21.3,37.75 11.25,4.15 12.05,10.55 26.3,14.05 27.4,16.75 26.3,25.85 15.9,8.05 13.1,8.05 14.5,6.65 3.05,28.25 10.35,30.45 13.9,30.1 11.15,33.65 22.5,28.1 13.7,33.55 2.25,36.9 26.75,35.95 28,28.4 28.05,21.1 7.65,28.3 4.6,10.25 7.45,6.15 20.8,5.25 24.6,10.15 19.6,12.45 9.45,10.9
  pour Route2: -3.3,40.8 -3.3,-2.7 32.9,-2.7 32.9,40.8
  pour Bottom: 11.5,1.35 17.5,1.35 17.5,3.45 16.85,4.1 12.1,4.1 11.5,3.5
  pour Top: 10.95,4.4 10.95,2.75 12.3,2.75 12.3,1.95 12.6,1.65 16.7,1.6 16.7,4.4
  pour Bottom (rank 4): -1.8,40.05 -1.8,4.8 29.05,4.8 29.05,40.05
INT  (via drill 0.3)
  Top 0.15: v17.25,11.25 17.25,12.8 20.55,16.1 21.1,16.1 21.8,16.8 21.8,17.3 22.35,17.85 22.35,20.3 v21.1,21.55
  Bottom 0.15: U$2.1 15.43,22.12 16.75,20.8 20.35,20.8 v21.1,21.55 | U4.25 16.96,10.96 v17.25,11.25
LED1
  Bottom 0.15: U4.9 12.04,5.89 11.7,5.55 10.8,5.55 9.05,7.3 9.05,9 6.8,11.25 5.1,11.25 R5.1
LED2
  Bottom 0.15: U4.10 11.65,6.8 11.2,6.35 10.45,6.35 9.4,7.4 9.4,9.1 5.94,12.56 R7.1
LED3
  Bottom 0.15: U4.7 13.26,5.21 12.8,4.75 11,4.75 10.55,4.3 9.8,4.3 R8.1 9.83,4.45
LED4
  Bottom 0.15: U4.8 12.29,5.59 11.85,5.15 10.58,5.15 R9.1
MUX_ADDR0  (via drill 0.3)
  Top 0.15: v15.4,12.6 15.4,13.35 17.25,15.2 18.65,15.2 20.25,16.8 20.85,16.8 21.1,17.05 21.1,17.6 21.65,18.15 21.65,19 v21.1,19.55 20.25,20.4 v20.25,21.7
  Bottom 0.15: U$1.10 12.28,21.93 14.35,19.85 20.6,19.85 20.9,19.55 v21.1,19.55 | U4.21 14.75,11.3 15.1,11.65 15.1,12.3 v15.4,12.6 | U$2.10 21.27,22.32 21.1,22.15 20.7,22.15 v20.25,21.7
MUX_ADDR1  (via drill 0.3)
  Top 0.15: v20.95,20.55 21.25,20.55 22,19.8 22,18 21.45,17.45 21.45,16.95 20.95,16.45 20.4,16.45 16.5,12.55 v16.35,12.55
  Bottom 0.15: U$1.11 12.93,21.82 14.5,20.25 20.65,20.25 v20.95,20.55 21.8,21.4 21.8,22.15 21.93,22.27 U$2.11 | U4.22 15.26,11.16 15.75,11.65 15.75,11.95 v16.35,12.55
MUX_ADDR2
  Bottom 0.15: U$2.14 21.9,15.82 21.9,14.95 21.4,14.45 19.45,14.45 18.55,13.55 14.7,13.55 14,14.25 14,14.95 14.15,15.1 14.15,16.6 13.9,16.85 13.15,16.85 12.93,16.62 U$1.14 12.93,14.62 11.25,12.95 11.25,11.2 11.4,11.05 11.4,9.55 11.65,9.3 U4.15
MUX_ADDR3
  Bottom 0.15: U$1.13 13.57,13.97 | U$2.13 22.57,15.02 21.65,14.1 19.55,14.1 18.65,13.2 14.35,13.2 13.57,13.97 | U4.18 13.26,13.65 13.57,13.97
N$1
  Bottom 0.15: C10.1 15.28,1.97 Q1.1 14.6,2.65 14.6,3.5 14.9,3.8 15.25,3.8 15.75,4.29 U4.2
N$2
  Bottom 0.15: C9.1 13.58,2.93 Q1.3 13.75,3.15 14.75,4.15 15.05,4.15 15.4,4.5 15.4,4.9 15.26,5.04 U4.3 15.26,5.14
N$3
  pour Bottom (no thermals): 8.45,33.1 8.45,32.45 8.6,32.3 11.1,32.3 11.1,32.45 10.55,32.45 10.45,32.45 9.95,32.95 9.95,33.1
N$4
  Bottom 0.15: U4.11 11.64,7.29 11.4,7.05 11.4,7 11.1,6.7 10.55,6.7 9.75,7.5 9.75,9.5 5.25,14 5.25,18.6 4.01,19.84 K1.1
N$5
  Bottom 0.25: U2.3 13.8,31.9 | U2.2 13.8,32.4
  Bottom 0.5: D1.- C7.1 13.8,31.45 13.8,31.9 13.8,32.4
N$6
  pour Bottom (no thermals): 6.9,31.3 7.9,31.3 8.55,31.95 11.1,31.95 11.1,31.8 10.35,31.8 9.95,31.4 9.95,31.1 9.25,30.4 9.25,28.95 8.35,28.95 8.35,30.3 8.15,30.5 6.9,30.5
N$7
  cutout Route2: 14.85,4.25 12.2,4.25 11.35,3.4 11.35,1.35 11.25,1.35 11.25,3.45 12.15,4.35 14.85,4.35
  cutout Route2: 16.25,4.25 16.8,4.25 17.65,3.4 17.65,1.35 17.75,1.35 17.75,3.45 16.85,4.35 16.25,4.35
N$8
  Top 0.15: R1.1 12.02,34.65 LED2.C
N$9  (via drill 0.3)
  Top 0.15: LED12.A 24.32,31.68 23,33 17.35,33 LED13.A 13.7,32.25 12.9,33.05 11.55,33.05 10.8,32.3 LED14.C 10.3,31.75 7,31.75 5.93,30.68 LED3.A 3.98,30.68 2.4,29.1 2.4,27.05 2.55,26.9 2.55,25.5 LED4.C 1.2,24.15 1.2,22.55 1.75,22 2.25,22 3.05,21.2 3.05,20.45 2.9,20.3 2.9,16.35 3.95,15.3 v4.2,15.3 | LED12.A 24.72,30.68 | LED11.C 28.15,25.5 28.15,26.9 24.37,30.68 LED12.A
  Bottom 0.15: R5.2 3.55,12.8 3.55,14.65 v4.2,15.3
N$10  (via drill 0.3)
  Top 0.15: 5.8,31.8 LED3.C 5.27,31.82 5.05,31.6 4.4,31.6 2.05,29.25 2.05,26.6 LED4.A 0.85,25.4 0.85,20.2 LED5.C 2.55,18.5 2.55,16.2 3.55,15.2 3.55,14.9 v4.15,14.3 4.15,13.65 LED6.A | 23.25,12.12 LED10.C 24.48,12.08 25.45,13.05 25.45,14.95 26.8,16.3 26.8,17.25 LED9.A 28.15,18.6 28.15,20.1 26.45,21.8 26.45,24.85 25.7,25.6 25.7,26.6 24.8,27.5 24.8,28.5 21.85,31.45 21.6,31.45 21.5,31.55 19.4,31.55 19,31.15 18.05,31.15 17.7,30.8 15.65,30.8 15.3,31.15 12.3,31.15 11,29.85 10.1,29.85 9.25,30.7 7.3,30.7 6.25,29.65 5.85,29.65 4.35,28.15 4.35,26.65 3.6,25.9 3.6,25.2 4.1,24.7 4.1,19.95 3.95,19.8 3.95,17.95 v4.2,17.7
  Bottom 0.15: R7.2 4.61,13.84 v4.15,14.3 4.85,15 4.85,15.8 4.55,16.1 4.55,17.1 4.2,17.45 v4.2,17.7
N$11  (via drill 0.3)
  Top 0.15: LED7.A 13.4,9.2 12.55,8.35 11.45,8.35 11,8.8 10.65,8.8 LED8.C 9.55,8.5 9.55,6.9 9.8,6.65 9.8,6 9.45,5.65 8.55,5.65 v8.45,5.75 8.45,6.35 8.85,6.75 8.85,9.4 6.2,12.05 5.75,12.05 LED6.C 4.52,12.08 3.5,13.1 3.5,14.4 v2.95,14.95 2.95,15.3 2.2,16.05 2.2,17.25 LED5.A | v3.9,16.7 3.6,17 3.6,20 3.75,20.15 3.75,24.55 3.25,25.05 3.25,26.05 4,26.8 4,28.3 5.7,30 6.15,30 7.2,31.05 11.7,31.05 12.15,31.5 15.5,31.5 15.85,31.15 17.6,31.15 17.95,31.5 18.9,31.5 19.3,31.9 21.6,31.9 21.7,31.8 23.17,31.8 LED12.C 23.18,30.62 25.15,28.65 25.15,27.65 25.45,27.35 26.2,27.35 LED11.A
  Bottom 0.15: R8.2 9.06,5.14 v8.45,5.75 | v2.95,14.95 2.95,15.75 v3.9,16.7
N$12  (via drill 0.3)
  Top 0.15: v9.2,6.25 9.2,9.8 | LED7.C 17.9,10.05 16.45,10.05 15.95,9.55 12.2,9.55 LED8.A 11,10.05 9.45,10.05 9.2,9.8 | LED10.A 24.42,14.37 26.45,16.4 26.45,18.5 LED9.C 26.45,20.2 v26.45,20.55 | 9.2,9.8 4.8,14.2 4.8,15.55 4.35,16 3.75,16 3.25,16.5 3.25,20.15 3.4,20.3 3.4,24.4 2.9,24.9 2.9,26.2 3.65,26.95 3.65,28.45 5.55,30.35 6.05,30.35 7.1,31.4 11.55,31.4 LED14.A 12.8,31.85 15.7,31.85 16.05,31.5 17.45,31.5 LED13.C 21.85,32.25 v22,32.4
  Bottom 0.15: v9.2,6.25 9.71,5.74 R9.2 | v26.45,20.55 25.65,20.55 24.95,21.25 24.95,27.55 23.9,28.6 23.9,30.5 v22,32.4 22.3,32.1
N$13  (via drill 0.3)
  Top 0.15: v24,20.45 24,22.8 v22.4,24.4
  Bottom 0.15: R4.2 24,19.93 v24,20.45 | JP1.P$2 14.7,36.92 14.7,33.55 15.7,32.55 17.25,32.55 18.65,31.15 18.65,27.25 19.5,26.4 21.9,26.4 22.65,25.65 22.65,24.65 v22.4,24.4
N$14  (via drill 0.3)
  Top 0.15: v22,25.2 22.45,25.2 24.9,22.75 v24.9,20.45
  Bottom 0.15: R6.2 24.9,20.13 v24.9,20.45 | JP1.P$3 14.35,36.21 14.35,33.4 15.55,32.2 17.15,32.2 18.3,31.05 18.3,27 19.25,26.05 21.15,26.05 v22,25.2
RXD
  Bottom 0.15: U4.30 17.51,7.29 17.6,7.2 18.45,7.2 19.2,7.95 19.2,9.85 24.1,14.75 24.1,17.37 R6.1
SCL  (via drill 0.3)
  Top 0.15: U1.10 15.3,4.4 15.6,4.7 15.6,5.1 16.7,6.2 19.15,6.2 19.6,6.65 19.6,9.75 18.75,10.6 16.5,10.6 14.4,12.7 v13.9,12.7 13.9,13.25 14.3,13.65 15.15,13.65 17.05,15.55 18.5,15.55 19.57,16.62 R2.1 19.57,18.58 19.15,19 19.15,19.55 18.11,20.59 B1.11
  Bottom 0.15: U4.19 13.74,12.54 v13.9,12.7
SDA  (via drill 0.3)
  Top 0.15: v9.35,11.85 v14.4,11.85
  Bottom 0.15: U$1.1 6.42,22.23 6.5,22.15 6.5,17.4 5.95,16.85 5.95,13.85 7.95,11.85 v9.35,11.85 | U4.20 14.25,11.1 14.4,11.25 v14.4,11.85
SWCLK  (via drill 0.3)
  Top 0.15: v18.6,12.25 18.6,13.15 20.85,15.4 21.4,15.4 22.15,16.15 24,16.15 v25.45,17.6
  Bottom 0.15: U4.24 16.25,11.1 17.4,12.25 v18.6,12.25 | 27.31,18 P11.PIN 25.77,17.92 v25.45,17.6
SWDIO  (via drill 0.3)
  Top 0.15: v19.8,13.5 21.35,15.05 21.5,15.05 22.2,15.75 v24.85,15.75
  Bottom 0.15: U4.23 15.75,11.1 17.5,12.85 19.15,12.85 v19.8,13.5 | P12.PIN 26.25,15.75 v24.85,15.75
TXD
  Bottom 0.15: U4.29 17.5,7.8 17.75,7.55 18.35,7.55 18.85,8.05 18.85,9.95 23.75,14.85 23.75,18.12 R4.1
VDD  (via drill 0.3)
  Top 0.15: R2.2 21.05,18.02 v21.05,18.65
  Top 0.5: v12,19.85 12.18,20.02 B1.2
  Bottom 0.15: U4.5 14.25,5.05 14.05,4.85 13.8,4.85 v13.55,4.6 | C1.1 6.9,14.35 v6.65,14.6 6.42,14.82 U$1.24 | U$2.24 15.43,15.07 v15.05,14.7 15.3,14.45 C5.1 | C14.1 18.02,5.55 v17,5.55 16.96,5.59 U4.1 | U4.17 12.75,11.73 C13.1 12.73,12.52 v12.65,12.6 | v24.85,11.45 24.85,11.87 P10.PIN
  Bottom 0.5: IC2.5 C4.1 | C4.1 | C4.1 v25.8,21.3
  pour Route3: 3.9,-2.2 25.4,-1.65 34.35,25.5 -4.1,25.5
VEE  (via drill 0.3)
  Top 0.15: U1.11 16.2,3.8 16.65,3.35 16.65,2.65 16.2,2.2 U1.1 16.14,2.14 15.6,1.6 13.4,1.6 12.9,2.1 U1.5
  Top 0.4: C2.1 17.02,4.65 v16.35,4.65 16.35,4.05 U1.11
  Top 0.5: B1.3 12.89,18.96 v12.65,19.2 12.5,19.05 11.45,19.05 10.95,18.55 8.5,18.55 7.75,17.8 6.65,17.8 5.75,18.7 v5.75,19.65
  Route3 0.3: v16.35,4.65 15.2,3.5 13.05,3.5 9.6,6.95 9.6,9.6 7.2,12 v7.2,13.45 6.2,13.45 5.75,13.9 v5.75,19.65
  Bottom 0.15: R3.2 7.35,13.3 v7.2,13.45
  Bottom 0.5: v5.75,19.65 5.55,19.85 5.55,25.4 6.3,26.15 C6.1 IC1.5

### Text on the board
tPlace: + | - | PWR | B | SIG | C | SIG | V1.0 | SSSLidar | PWR | A | 3
bPlace: + | - | DXLD | 20160908 | C | G | I | !R | 2 | V | 1